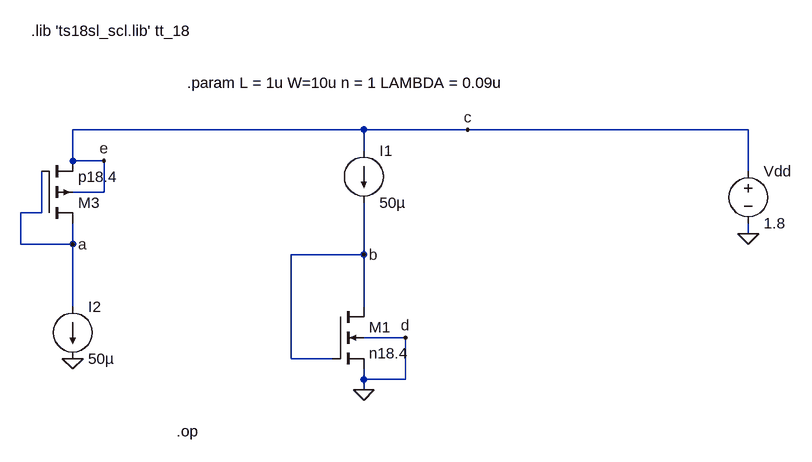
[diagram p0: schematic diffamp.asc]
diffamp.asc, the LTspice schematic file:
Version 4
SHEET 1 1308 704
WIRE 640 224 192 224
WIRE 800 224 640 224
WIRE 1232 224 800 224
WIRE 640 256 640 224
WIRE 192 272 192 224
WIRE 240 272 192 272
WIRE 1232 288 1232 224
WIRE 240 320 240 272
WIRE 240 320 192 320
WIRE 144 352 144 288
WIRE 144 352 112 352
WIRE 1232 384 1232 368
WIRE 112 400 112 352
WIRE 192 400 192 368
WIRE 192 400 112 400
WIRE 640 416 640 336
WIRE 640 416 528 416
WIRE 192 496 192 400
WIRE 640 496 640 416
WIRE 704 544 640 544
WIRE 528 576 528 416
WIRE 592 576 528 576
WIRE 640 608 640 592
WIRE 704 608 704 544
WIRE 704 608 640 608
WIRE 640 624 640 608
FLAG 1232 384 0
FLAG 192 576 0
FLAG 192 400 a
FLAG 640 416 b
FLAG 800 224 c
FLAG 240 272 e
FLAG 640 624 0
FLAG 704 544 d
SYMBOL nmos4 592 496 R0
SYMATTR InstName M1
SYMATTR Value n18.4
SYMATTR Value2 l={L} w={W} ad={5*W*LAMBDA} as={5*W*LAMBDA} pd={10*LAMBDA+2*W} ps={10*LAMBDA+2*W}
SYMBOL voltage 1232 272 R0
WINDOW 123 0 0 Left 0
WINDOW 39 0 0 Left 0
SYMATTR InstName Vdd
SYMATTR Value 1.8
SYMBOL current 640 256 R0
WINDOW 123 0 0 Left 0
WINDOW 39 0 0 Left 0
SYMATTR InstName I1
SYMATTR Value 50µ
SYMBOL current 192 496 R0
WINDOW 123 0 0 Left 0
WINDOW 39 0 0 Left 0
SYMATTR InstName I2
SYMATTR Value 50µ
SYMBOL pmos4 144 368 M180
SYMATTR InstName M3
SYMATTR Value p18.4
SYMATTR Value2 l={L} w={n*W} ad={5*W*LAMBDA} as={5*W*LAMBDA} pd={10*LAMBDA+2*W} ps={10*LAMBDA+2*W}
TEXT 128 72 Left 2 !.lib 'ts18sl_scl.lib' tt_18
TEXT 368 152 Left 2 !.param L = 1u W=10u n = 1 LAMBDA = 0.09u
TEXT 352 688 Left 2 !.op

The netlist it stands for:
* diffamp.asc
M1 b b 0 0 n18.4 l={L} w={W} ad={5*W*LAMBDA} as={5*W*LAMBDA} pd={10*LAMBDA+2*W} ps={10*LAMBDA+2*W}
Vdd e 0 1.8
I1 e b 50µ
I2 a 0 50µ
M3 a a e e p18.4 l={L} w={n*W} ad={5*W*LAMBDA} as={5*W*LAMBDA} pd={10*LAMBDA+2*W} ps={10*LAMBDA+2*W}
.model NMOS NMOS
.model PMOS PMOS
.lib standard.mos
.lib 'ts18sl_scl.lib' tt_18
.param L = 1u W=10u n = 1 LAMBDA = 0.09u
.op
.backanno
.end

* Results of the author's LTspice run, read from the files saved beside the schematic
* Operating Point:
*   V(b) = 662.8 mV
*   V(e) = 1.8 V
*   V(a) = 877.4 mV
*   Id(M3) = -50 µA
*   Ig(M3) = 0 A
*   Ib(M3) = 922.6 fA
*   Is(M3) = 50 µA
*   Id(M1) = 50 µA
*   Ig(M1) = 0 A
*   Ib(M1) = -664.7 fA
*   Is(M1) = -50 µA
*   I(I2) = 50 µA
*   I(I1) = 50 µA
*   I(Vdd) = -100 µA
* From the log:
*   Semiconductor Device Operating Points:
*                           --- BSIM3 MOSFETS ---
*   Name:        m3          m1
*   Model:      p18.4       n18.4
*   Id:       -5.00e-05    5.00e-05
*   Vgs:      -9.23e-01    6.63e-01
*   Vds:      -9.23e-01    6.63e-01
*   Vbs:       0.00e+00    0.00e+00
*   Vth:      -4.18e-01    4.79e-01
*   Vdsat:    -4.20e-01    1.91e-01
*   Gm:        1.83e-04    4.29e-04
*   Gds:       1.75e-06    4.70e-05
*   Gmb        5.82e-05    8.47e-05
*   Cbd:       7.62e-15    8.41e-15
*   Cbs:       9.68e-15    1.04e-14
*   Cgsov:     2.60e-15    2.20e-15
*   Cgdov:     2.60e-15    2.20e-15
*   Cgbov:     0.00e+00    0.00e+00
*   dQgdVgb:   7.30e-14    6.38e-14
*   dQgdVdb:  -2.65e-15   -2.24e-15
*   dQgdVsb:  -6.34e-14   -5.53e-14
*   dQddVgb:  -3.05e-14   -2.71e-14
*   dQddVdb:   1.03e-14    1.06e-14
*   dQddVsb:   3.67e-14    3.02e-14
*   dQbdVgb:  -1.21e-14   -9.61e-15
*   dQbdVdb:  -7.65e-15   -8.44e-15
*   dQbdVsb:  -2.22e-14   -1.77e-14